# Altium project DS_Motor.PrjPCB
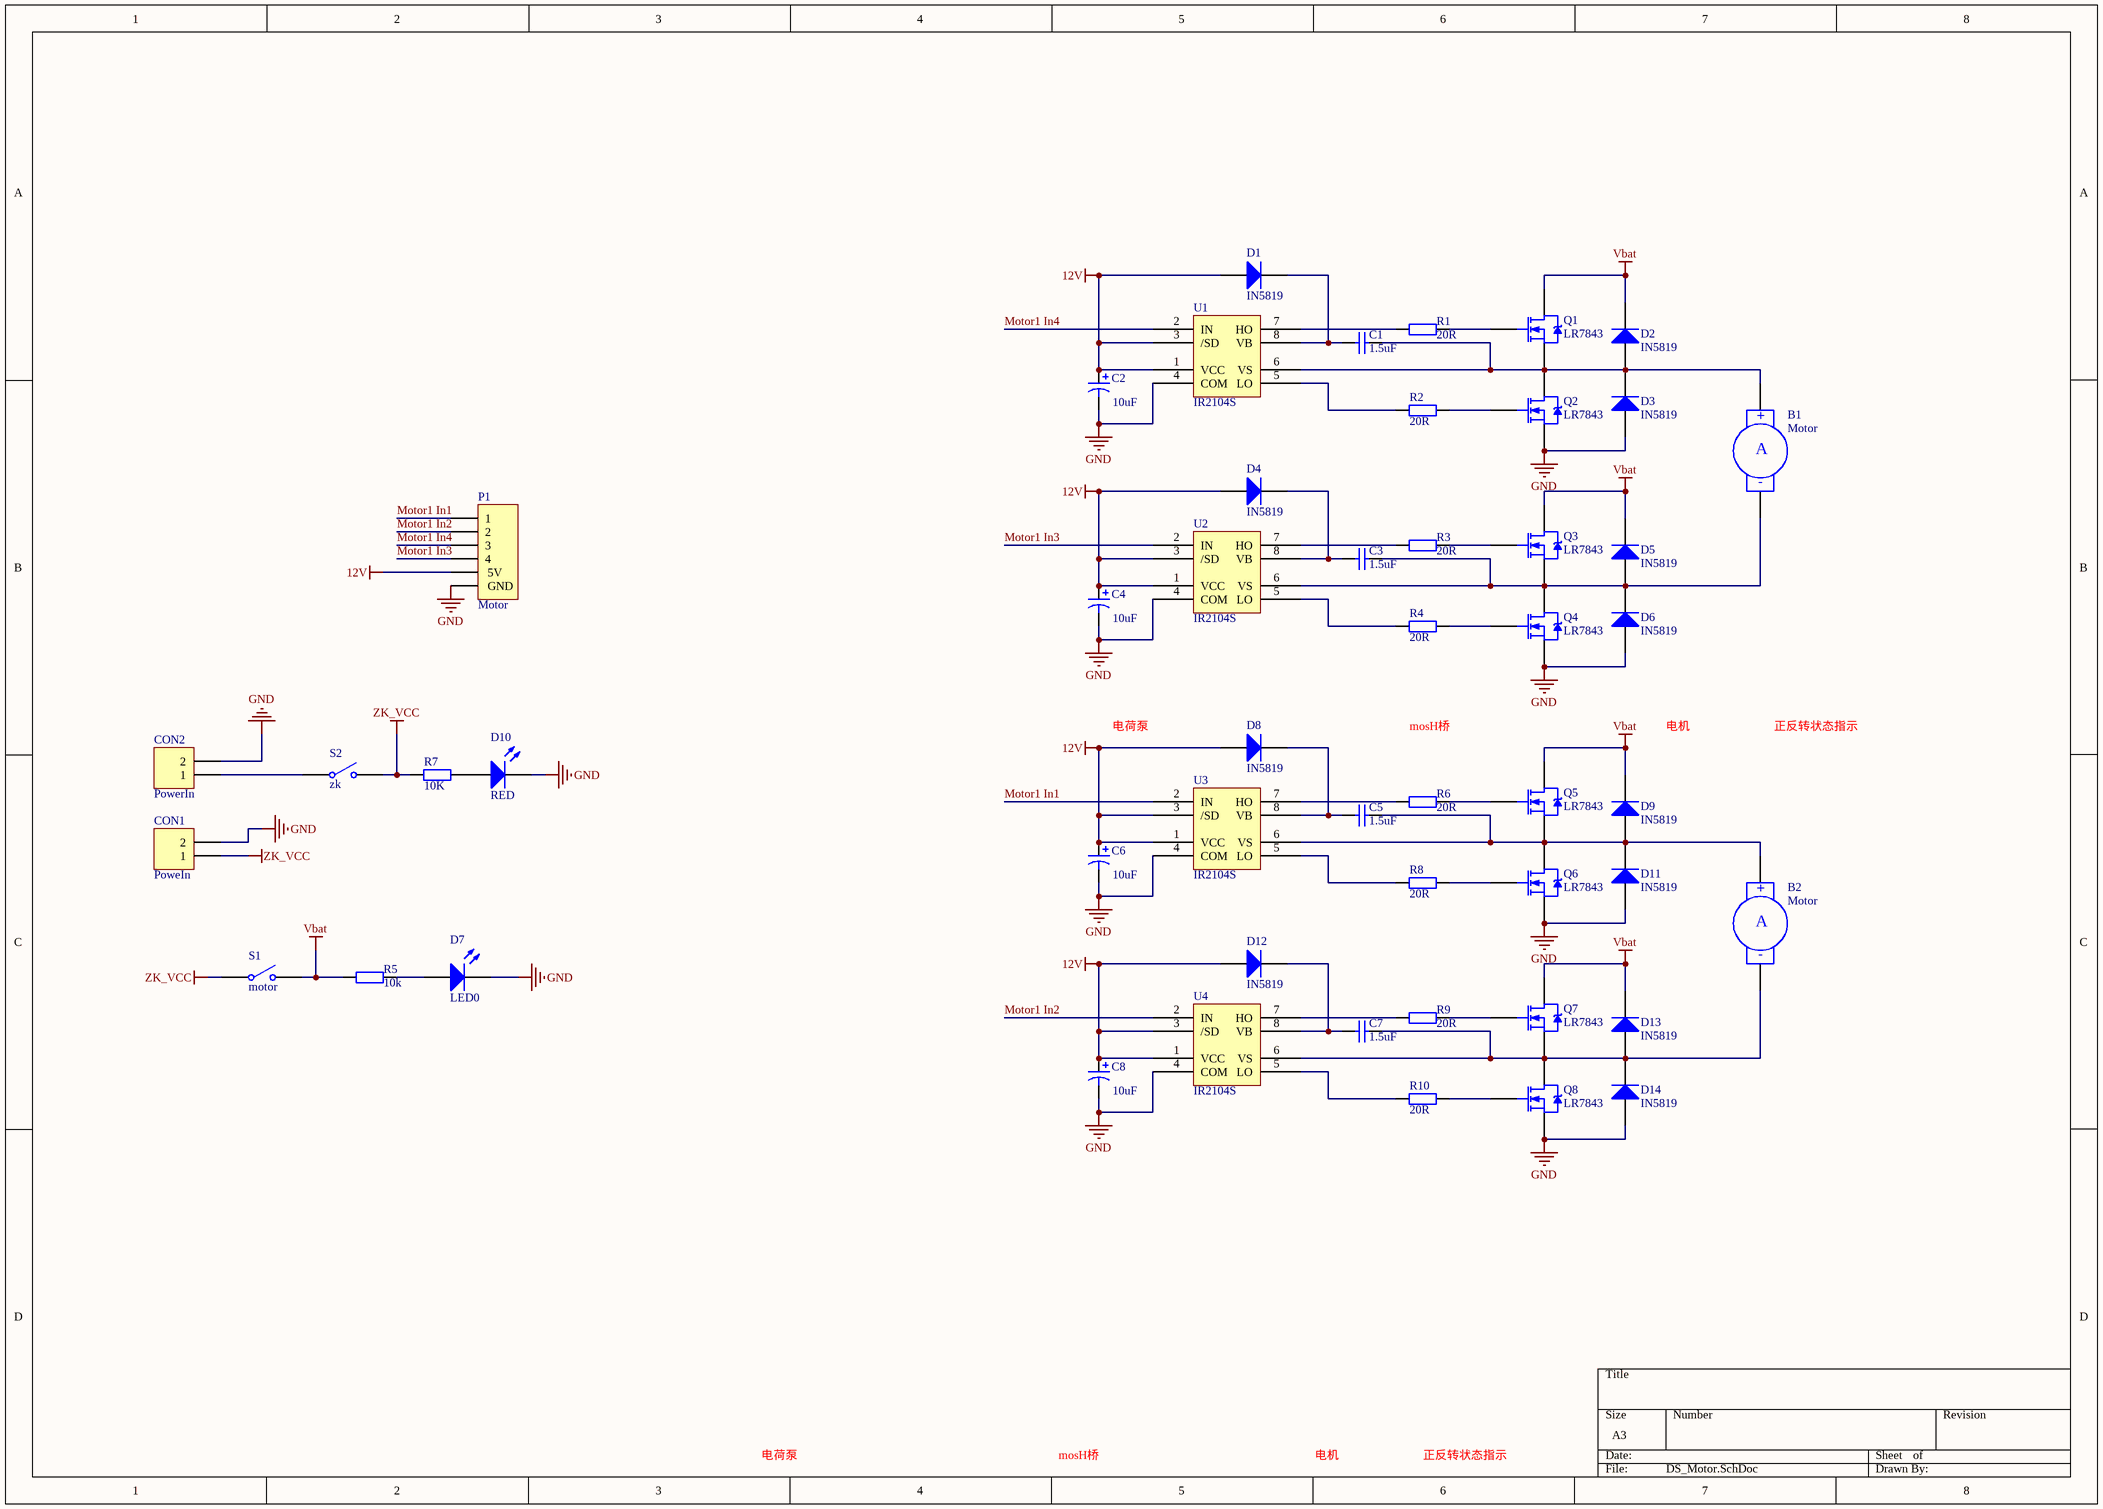
[diagram p0: DS_Motor.SchDoc]
1 sheet, 51 parts. Net scope: global (net labels, ports and power ports of the same name join across sheets).
Board files: DS_Motor.PcbDoc, DS_Motor1.0.PcbDoc

## Sheet DS_Motor.SchDoc
size A3

### Parts
B1  Motor  [KF301-2P]
B2  Motor  [KF301-2P]
C1  1.5uF  [0805]
C2  10uF  [0805LED]
C3  1.5uF  [0805]
C4  10uF  [0805LED]
C5  1.5uF  [0805]
C6  10uF  [0805LED]
C7  1.5uF  [0805]
C8  10uF  [0805LED]
CON1  PoweIn  [KF301-2P]
CON2  PowerIn  [DIZUO]
D1  IN5819  [0805LED]
D2  IN5819  [0805LED]
D3  IN5819  [0805LED]
D4  IN5819  [0805LED]
D5  IN5819  [0805LED]
D6  IN5819  [0805LED]
D7  LED0  [0805LED]
D8  IN5819  [0805LED]
D9  IN5819  [0805LED]
D10  RED  [0805LED]
D11  IN5819  [0805LED]
D12  IN5819  [0805LED]
D13  IN5819  [0805LED]
D14  IN5819  [0805LED]
P1  Motor  [HDR1X6]
Q1  LR7843  [LR7843]
Q2  LR7843  [LR7843]
Q3  LR7843  [LR7843]
Q4  LR7843  [LR7843]
Q5  LR7843  [LR7843]
Q6  LR7843  [LR7843]
Q7  LR7843  [LR7843]
Q8  LR7843  [LR7843]
R1  20R  [0805]
R2  20R  [0805]
R3  20R  [0805]
R4  20R  [0805]
R5  10k  [0805]
R6  20R  [0805]
R7  value 10K  [0805]  (hidden comment: Res2)
R8  20R  [0805]
R9  20R  [0805]
R10  20R  [0805]
S1  motor  [SWITCH-MID]
S2  zk  [SWITCH-MID]
U1  IR2104S  [IR2104S]
U2  IR2104S  [IR2104S]
U3  IR2104S  [IR2104S]
U4  IR2104S  [IR2104S]

### Nets
12V: C2.1 C4.1 C6.1 C8.1 D1.1(A) D4.1(A) D8.1(A) D12.1(A) P1.5(5V) U1.1(VCC) U1.3(/SD) U2.1(VCC) U2.3(/SD) U3.1(VCC) U3.3(/SD) U4.1(VCC) U4.3(/SD)
GND: C2.2 C4.2 C6.2 C8.2 CON1.2 CON2.2 D3.1(A) D6.1(A) D7.2(K) D10.2(K) D11.1(A) D14.1(A) P1.6(GND) Q2.3(S) Q4.3(S) Q6.3(S) Q8.3(S) U1.4(COM) U2.4(COM) U3.4(COM) U4.4(COM)
Vbat: D2.2(K) D5.2(K) D9.2(K) D13.2(K) Q1.2(D) Q3.2(D) Q5.2(D) Q7.2(D) R5.1 S1.2(NO)
ZK_VCC: CON1.1 R7.2 S1.1(COMMON) S2.2(NO)
Motor1 In1: P1.1 U3.2(IN)
Motor1 In2: P1.2 U4.2(IN)
Motor1 In3: P1.4 U2.2(IN)
Motor1 In4: P1.3 U1.2(IN)
NetB1_1: B1.1(+) C1.2 D2.1(A) D3.2(K) Q1.3(S) Q2.2(D) U1.6(VS)
NetB1_2: B1.2(-) C3.2 D5.1(A) D6.2(K) Q3.3(S) Q4.2(D) U2.6(VS)
NetB2_1: B2.1(+) C5.2 D9.1(A) D11.2(K) Q5.3(S) Q6.2(D) U3.6(VS)
NetB2_2: B2.2(-) C7.2 D13.1(A) D14.2(K) Q7.3(S) Q8.2(D) U4.6(VS)
NetC1_1: C1.1 D1.2(K) U1.8(VB)
NetC3_1: C3.1 D4.2(K) U2.8(VB)
NetC5_1: C5.1 D8.2(K) U3.8(VB)
NetC7_1: C7.1 D12.2(K) U4.8(VB)
NetCON2_1: CON2.1 S2.1(COMMON)
NetD7_1: D7.1(A) R5.2
NetD10_1: D10.1(A) R7.1
NetQ1_1: Q1.1(G) R1.2
NetQ2_1: Q2.1(G) R2.2
NetQ3_1: Q3.1(G) R3.2
NetQ4_1: Q4.1(G) R4.2
NetQ5_1: Q5.1(G) R6.2
NetQ6_1: Q6.1(G) R8.2
NetQ7_1: Q7.1(G) R9.2
NetQ8_1: Q8.1(G) R10.2
NetR1_1: R1.1 U1.7(HO)
NetR2_1: R2.1 U1.5(LO)
NetR3_1: R3.1 U2.7(HO)
NetR4_1: R4.1 U2.5(LO)
NetR6_1: R6.1 U3.7(HO)
NetR8_1: R8.1 U3.5(LO)
NetR9_1: R9.1 U4.7(HO)
NetR10_1: R10.1 U4.5(LO)

### Notes on the sheet
- 电荷泵
- mosH桥
- 电机
- 正反转状态指示
- (in symbol Motor Servo) A

### Library data of the parts
B1 B2 = Motor Servo: Servo Motor; Published: 24-Mar-1999; LatestRevisionDate: 17-Jul-2002; LatestRevisionNote: Re-released for DXP Platform.; PackageReference: RAD-0.4; Publisher: Altium Limited; PackageDescription: Radial Cap, Thru-Hole; 2 Leads; 0.4 in Pin Spacing
C1 C3 C5 C7 = Cap Semi: Capacitor (Semiconductor SIM Model); Published: 8-Jun-2000; LatestRevisionDate: 29-May-2009; LatestRevisionNote: IPC-7351 Footprint Added.; PackageReference: C1206; Publisher: Altium Limited; PackageDescription: Chip Capacitor; Value: 1.5uF
C2 C4 C6 C8 = Cap Pol3: Polarized Capacitor (Surface Mount); Published: 8-Jun-2000; LatestRevisionDate: 29-May-2009; LatestRevisionNote: IPC-7351 Footprint Added.; PackageReference: C0805; Publisher: Altium Limited; PackageDescription: Chip Capacitor; Value: 10uF
CON1 CON2 = Header 2: Header, 2-Pin; LatestRevisionDate: 17-Jul-2002; LatestRevisionNote: Re-released for DXP Platform.; Publisher: Altium Limited
D1-D6 D8 D9 D11-D14 = Diode: Default Diode; Published: 8-Jun-2000; LatestRevisionDate: 17-Jul-2002; LatestRevisionNote: Re-released for DXP Platform.; PackageVersion: Sep-1996; PackageReference: SMC; Publisher: Altium Limited; PackageDescription: DO-214-AB/SMC; 2 C-Bend Leads; Body 7.9 x 5.9 mm, inc. leads (LxW); Code_JEDEC: DO-214-AB
D7 = LED0: Typical INFRARED GaAs LED; Published: 8-Jun-2000; LatestRevisionDate: 08-Jul-2005; LatestRevisionNote: Mech Layer 1 removed.; PackageReference: LED-0; Publisher: Altium Limited; PackageDescription: LED; 2 Leads
D10 = LED2: Typical RED, GREEN, YELLOW, AMBER GaAs LED; Published: 8-Jun-2000; LatestRevisionDate: 17-Jul-2002; LatestRevisionNote: Re-released for DXP Platform.; PackageVersion: Feb-2002; PackageReference: 3.2X1.6X1.1; Publisher: Altium Limited; PackageDescription: SM LED; 2 Flat Leads
Q1-Q8 = NMOS-2: N-Channel Power MOSFET; Note: Pin 2 is electrically connected to pin 4.; Published: 8-Jun-2000; LatestRevisionDate: 17-Jul-2002; LatestRevisionNote: Re-released for DXP Platform.; DatasheetVersion: PD-9.814; PackageVersion: Feb-1997; PackageReference: TO-220AB; Publisher: Altium Limited; PackageDescription: TO, Thru-Hole, Vertical, Heatsink Mounted; 3 In-Line Leads; Pitch 2.54 mm; ComponentLink1Description: Manufacturer Link; ComponentLink1URL: http://www.irf.com/
R1-R10 = Res2: Resistor; Published: 8-Jun-2000; LatestRevisionDate: 17-Jul-2002; LatestRevisionNote: Re-released for DXP Platform.; PackageReference: AXIAL-0.4; Publisher: Altium Limited; PackageDescription: Axial Device, Thru-Hole; 2 Leads; 0.4 in Pin Spacing
  R1-R4 R6 R8-R10: Value: 20R
  R5: Value: 10k
S1 S2 = SW-SPST: Single-Pole, Single-Throw Switch; Published: 24-Mar-1999; LatestRevisionDate: 17-Jul-2002; LatestRevisionNote: Re-released for DXP Platform.; PackageReference: SPST-2; Publisher: Altium Limited; PackageDescription: Switch; 2 Leads